# EAGLE design SMC-DCc10 (EAGLE 9.0.1)
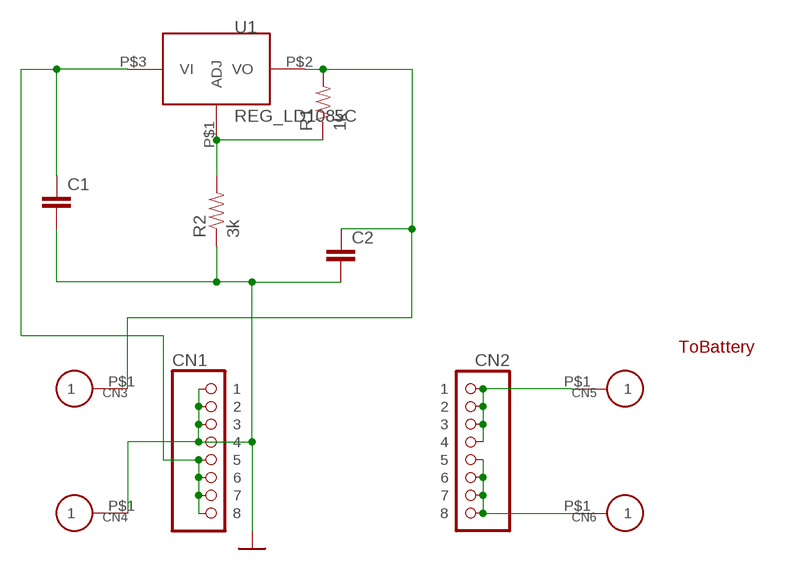
[diagram p0: schematic, sheet 1]

## Parts
C1  CAP0603  [0603]
C2  CAP1206  [1206]
CN1  CON_PINHD-1X8FPC05  [CON_8P_FPC05MM]
CN2  CON_PINHD-1X8FPC05  [CON_8P_FPC05MM]
CN3  CON_P01SMD1MM  [PAD_SMD1MM]
CN4  CON_P01SMD1MM  [PAD_SMD1MM]
CN5  CON_P01SMD1MM  [PAD_SMD1MM]
CN6  CON_P01SMD1MM  [PAD_SMD1MM]
R1  1k  RES0603  [0603]
R2  3k  RES0603  [0603]
U1  REG_LD1085C  [TO-252-3]

## Nets
GND: C1.2 C2.P$2 CN1.P$1 CN1.P$2 CN1.P$3 CN1.P$4 CN4.P$1 R2.1 ; supply symbol labelled POW_GND
N$2: CN2.P$5 CN2.P$6 CN2.P$7 CN2.P$8 CN6.P$1
N$3: C2.P$1 CN3.P$1 R1.2 U1.P$2(VO)
N$5: CN2.P$1 CN2.P$2 CN2.P$3 CN2.P$4 CN5.P$1
N$6: R1.1 R2.2 U1.P$1(ADJ)
N$13: C1.1 CN1.P$5 CN1.P$6 CN1.P$7 CN1.P$8 U1.P$3(VI)

## Notes on the sheet
- ToBattery

## Library data of the parts
C1 C2 = akita:CAP: Capacitor Standard 0603 ceramic capacitor, and 0.1" leaded capacitor.
CN1 CN2 = akita:CON_PINHD-1X8: PIN HEADER
CN3-CN6 = akita:CON_P01
R1 R2 = akita:RES: Resistor Basic schematic elements and footprints for 0603, 1206, and PTH resistors.
U1 = akita:REG_LD1085C: ST's adjustable series regulator, 3A

## Board
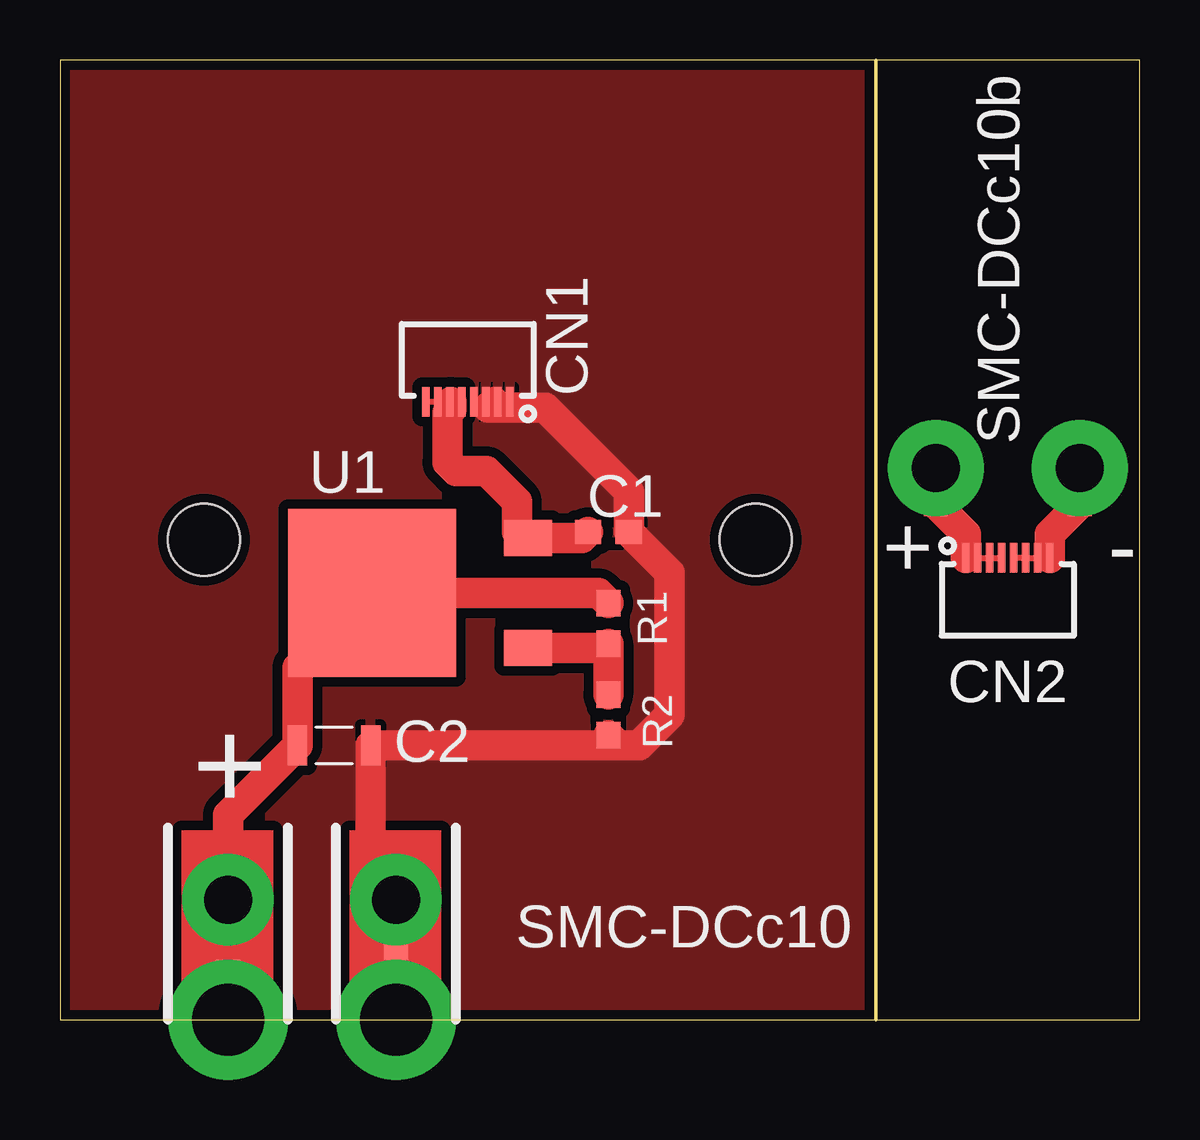
[diagram p1: board, top side]
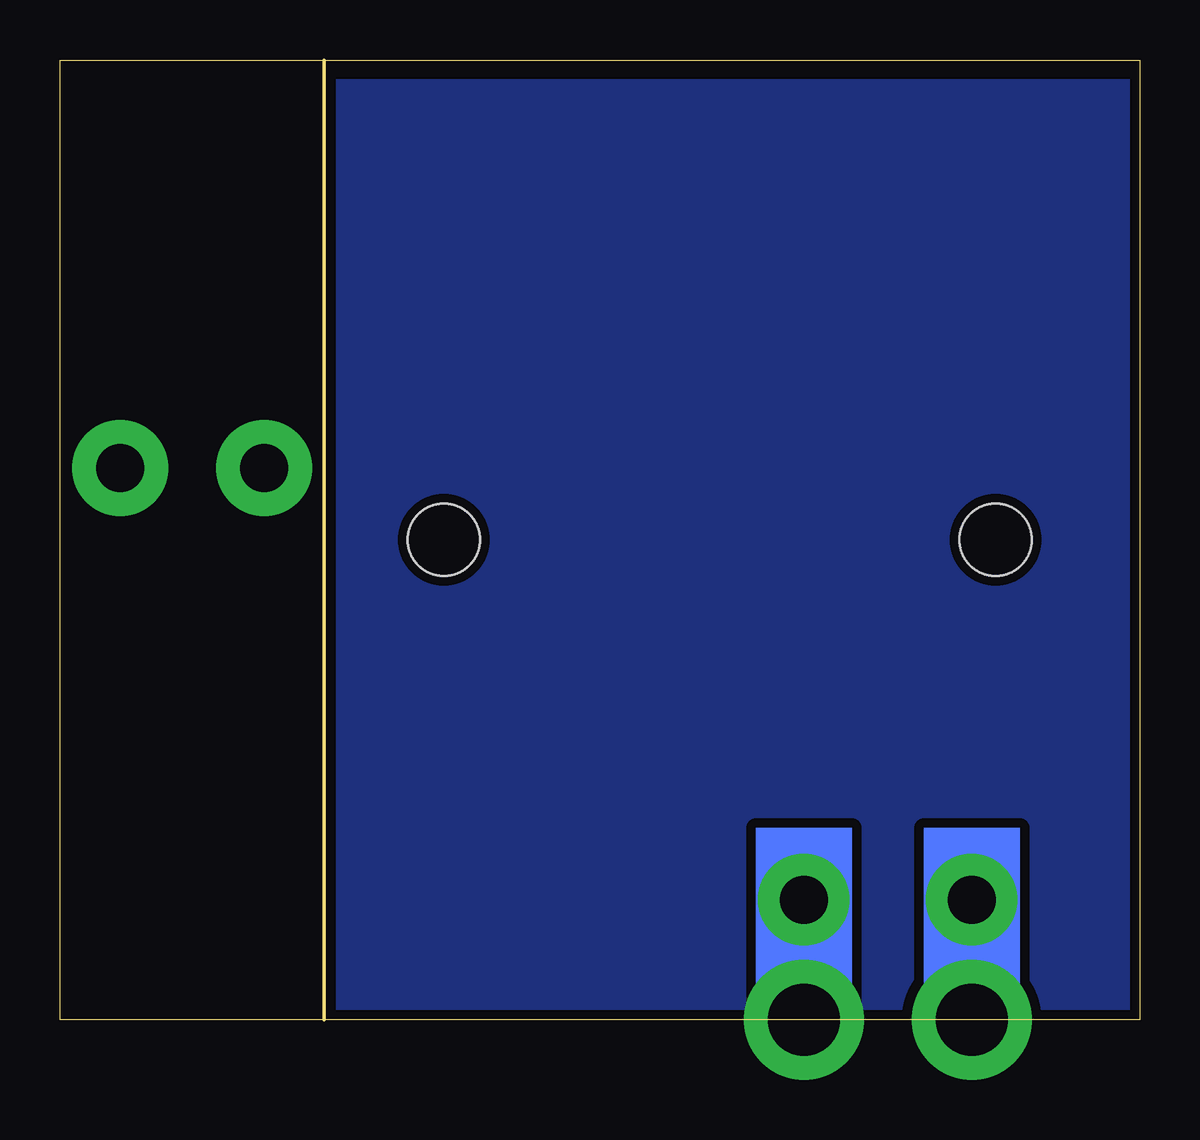
[diagram p2: board, bottom side, seen from below]

Size 45 x 40 mm. Coordinates in mm from the lower left corner, seen from the top.
Outline: 34,0 0,0 0,40 34,40
Outline: 34,0 45,0 45,40 34,40
Outline: 34,40 34,0
Copper layers (1*16): Top 0.035mm / dielectric 1.5mm / Bottom 0.035mm
Design rules "SeeedStudio_2layer_DRU_no_angle_20140221_Drill03mm": minimum track width 6mil, minimum drill 0.3mm, track to track 6mil, track to pad 6mil, pad to pad 6mil, via to via 6mil, smd to smd 0mil, copper to edge 10mil, drill to drill 10mil, minimum pad ring 10mil, minimum via ring 6mil, stop-mask expansion 2mil, vias tented up to drill 100mil, thermal gap 10mil
Holes 3 mm at 6,20 29,20

### Footprints (pad centres in the part's own frame; a part is rotated, then mirrored left to right if it is on the bottom)
0603 = smd 1.1 x 1: 1 -0.85,0; 2 0.85,0
1206 = smd 0.813 x 1.676: P$1 -1.524,0; P$2 1.524,0
CON_8P_FPC05MM = smd 0.3 x 1.21: P$1 -1.75,0.25; P$2 -1.25,0.25; P$3 -0.75,0.25; P$4 -0.25,0.25; P$5 0.25,0.25; P$6 0.75,0.25; P$7 1.25,0.25; P$8 1.75,0.25
PAD_SMD1MM = smd 1 x 1: P$1 0,0
TO-252-3 = smd 1.5 x 2: P$1 -2.3,-3; P$3 2.3,-3 | smd 7 x 7: P$2 0,3.5

### Placement (x,y rotation side)
C1  22.86,20.32 0 top
C2  11.43,11.43 0 top
CN1  17,26 180 top
CN2  39.5,19 0 top
CN3  7,2 0 top
CN4  14,3 90 top
CN5  36.5,21.5 0 top
CN6  42.5,21.5 0 top
R1  22.86,16.51 90 top
R2  22.86,12.7 90 top
U1  16.51,17.78 90 top

### Tracks (layer width: path | path; a pad name or v marks a point on that pad's centre or on a via)
GND  (via drill 2 pad 3.81, 3 pad 5)
  Top 0.254: CN1.P$4 CN1.P$3 18.1,25.75 CN1.P$2 CN1.P$1
  Top 1.27: 18.1,25.75 17.85,25.5 20.22,25.5 23.71,22.01 C1.2 25.4,18.63 25.4,12.7 24.13,11.43 23.28,11.43 | 23.28,11.43 C2.P$2 12.95,4.05 | 12.95,4.05 CN4.P$1 | R2.1 23.28,11.43 | CN4.P$1 v14,0 | 12.95,4.05 13.91,5 v14,5 CN4.P$1
  pour Top (isolate 0.406): 0,40 45,40 45,0 0,0
  pour Bottom (isolate 0.406): 0,39 45,39 45,0 0,0
N$1  (via drill 2 pad 4)
  other vias: 42.5,23
N$2
  Top 0.254: CN2.P$8 CN2.P$7 CN2.P$6 CN2.P$5
  Top 1.27: CN2.P$8 41.25,20.25 CN6.P$1
N$3  (via drill 2 pad 3.81, 3 pad 5)
  Top 1.27: R1.2 22.44,17.78 U1.P$2 9.91,14.68 C2.P$1 7,8.52 v7,5 CN3.P$1 v7,0
N$4  (via drill 2 pad 4)
  other vias: 36.5,23
N$5
  Top 0.254: CN2.P$4 CN2.P$3 CN2.P$2 CN2.P$1
  Top 1.27: CN2.P$1 37.75,20.25 CN5.P$1
N$6
  Top 1.27: U1.P$1 22.68,15.48 R1.1 R2.2
N$13
  Top 0.254: CN1.P$8 CN1.P$7 CN1.P$6 16.3,25.75 CN1.P$5
  Top 1.27: 16.3,25.75 16.31,25.73 16.31,25.45 16.15,25.29 16.15,23.22 16.51,22.86 17.78,22.86 19.05,21.59 19.05,20.32 19.27,20.32 U1.P$3 21.77,20.08 C1.1
(copper drawn outside any net)
  shapes: Bottom area x2, Top area x2

### Text on the board
tPlace: CN1 | U1 | SMC-DCc10b | C1 | + | - | CN2 | C2 | + | SMC-DCc10